# Altium schematic sheet Telemetria_Oficial.SchDoc
size A4; SheetNumber: 1; SheetTotal: 4
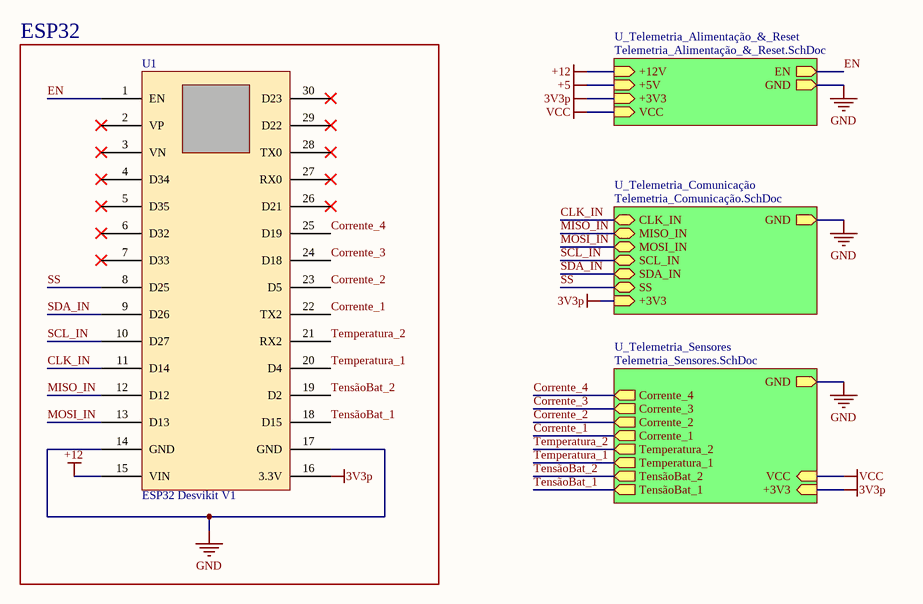
[diagram p0: Telemetria_Oficial.SchDoc]

## Parts
U1  value ESP32 Desvikit V1  [ESP32_Desvikit_v1]  (hidden comment: microcontrolador)

## Blocks framed on the sheet
ESP32: U1

## Sub-sheets
U_Telemetria_Alimentação_&_Reset = Telemetria_Alimentação_&_Reset.SchDoc: EN (out), GND (out), +12V (in), +5V (in), +3V3 (in), VCC (in)
U_Telemetria_Comunicação = Telemetria_Comunicação.SchDoc: CLK_IN (bidir), MISO_IN (bidir), MOSI_IN (bidir), SCL_IN (bidir), SDA_IN (bidir), SS (bidir), GND (out), +3V3 (in)
U_Telemetria_Sensores = Telemetria_Sensores.SchDoc: TensãoBat_1 (out), TensãoBat_2 (out), Temperatura_1 (out), Temperatura_2 (out), Corrente_1 (out), Corrente_2 (out), Corrente_3 (out), Corrente_4 (out), GND (out), +3V3 (in), VCC (in)

## Nets
3V3p: U1.16(3.3V) ; sheet U_Telemetria_Alimentação_&_Reset/+3V3, sheet U_Telemetria_Comunicação/+3V3, sheet U_Telemetria_Sensores/+3V3
+5: sheet U_Telemetria_Alimentação_&_Reset/+5V
+12: U1.15(VIN) ; sheet U_Telemetria_Alimentação_&_Reset/+12V
GND: U1.14(GND) U1.17(GND) ; sheet U_Telemetria_Alimentação_&_Reset/GND, sheet U_Telemetria_Comunicação/GND, sheet U_Telemetria_Sensores/GND
VCC: sheet U_Telemetria_Alimentação_&_Reset/VCC, sheet U_Telemetria_Sensores/VCC
CLK_IN: U1.11(D14) ; sheet U_Telemetria_Comunicação/CLK_IN
Corrente_1: U1.22(TX2) ; sheet U_Telemetria_Sensores/Corrente_1
Corrente_2: U1.23(D5) ; sheet U_Telemetria_Sensores/Corrente_2
Corrente_3: U1.24(D18) ; sheet U_Telemetria_Sensores/Corrente_3
Corrente_4: U1.25(D19) ; sheet U_Telemetria_Sensores/Corrente_4
EN: U1.1(EN) ; sheet U_Telemetria_Alimentação_&_Reset/EN
MISO_IN: U1.12(D12) ; sheet U_Telemetria_Comunicação/MISO_IN
MOSI_IN: U1.13(D13) ; sheet U_Telemetria_Comunicação/MOSI_IN
SCL_IN: U1.10(D27) ; sheet U_Telemetria_Comunicação/SCL_IN
SDA_IN: U1.9(D26) ; sheet U_Telemetria_Comunicação/SDA_IN
SS: U1.8(D25) ; sheet U_Telemetria_Comunicação/SS
Temperatura_1: U1.20(D4) ; sheet U_Telemetria_Sensores/Temperatura_1
Temperatura_2: U1.21(RX2) ; sheet U_Telemetria_Sensores/Temperatura_2
TensãoBat_1: U1.18(D15) ; sheet U_Telemetria_Sensores/TensãoBat_1
TensãoBat_2: U1.19(D2) ; sheet U_Telemetria_Sensores/TensãoBat_2

Not connected (* = marked no-connect by the designer): U1 2(VP)* 3(VN)* 4(D34)* 5(D35)* 6(D32)* 7(D33)* 26(D21)* 27(RX0)* 28(TX0)* 29(D22)* 30(D23)*

## Library data of the parts
U1 = ESP32 Desvikit v1: microcontrolador com moculo bluethoth e wifi